# Altium schematic sheet jn5169_blk.SchDoc
size A4; Date: 1/11/2016; Engineer: JBayalas; DocumentNumber: 9; Revision: V5.0.0; SheetNumber: 9; SheetTotal: 13
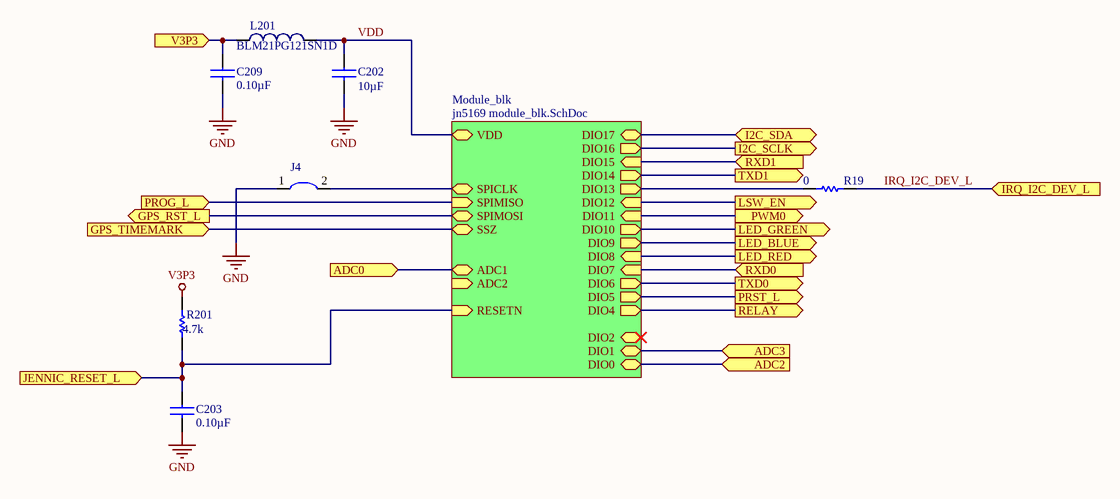
[diagram p0: jn5169_blk.SchDoc]

## Parts
C202  value 10µF  [C1206]  (hidden comment: GRM31CR71C106KAC7L)
C203  value 0.10µF  [C0402]  (hidden comment: GRM155R71H104ME14D)
C209  value 0.10µF  [C0402]  (hidden comment: GRM155R71H104ME14D)
J4  0603 Jumper  [0603 Jumper]  (value not drawn)
L201  BLM21PG121SN1D  [0805 INDUCTOR]
R19  value 0  [R0402]  (hidden comment: RC0402FR-070RL)
R201  value 4.7k  [R0402]  (hidden comment: RC0402FR-074K7P)

## Sub-sheets
Module_blk = jn5169 module_blk.SchDoc: ADC1 (bidir), SPICLK (bidir), SPIMISO (in), SPIMOSI (bidir), SSZ (bidir), DIO0 (bidir), DIO1 (bidir), DIO2 (bidir), VDD (bidir), DIO10 (out), DIO9 (out), DIO8 (in), DIO7 (in), DIO6 (out), DIO5 (out), DIO4 (out), DIO17 (bidir), DIO16 (out), DIO15 (in), DIO14 (out), RESETN (in), DIO13 (out), DIO12 (in), DIO11 (in), ADC2 (in)

## Ports
ADC0 (in), ADC2 (in), ADC3 (in), GPS_RST_L (out), GPS_TIMEMARK (in), I2C_SCLK (out), I2C_SDA (bidir), IRQ_I2C_DEV_L (in), JENNIC_RESET_L (in), LED_BLUE (out), LED_GREEN (out), LED_RED (out), LSW_EN (out), PROG_L (in), PRST_L (out), PWM0 (out), RELAY (out), RXD0 (in), RXD1 (in), TXD0 (out), TXD1 (out), V3P3 (in)

## Nets
GND: C202.2 C203.2 C209.2 J4.1
V3P3: R201.2
ADC0: port ADC0, sheet Module_blk/ADC1
ADC2: port ADC2, sheet Module_blk/DIO0
ADC3: port ADC3, sheet Module_blk/DIO1
GPS_RST_L: port GPS_RST_L, sheet Module_blk/SPIMOSI
GPS_TIMEMARK: port GPS_TIMEMARK, sheet Module_blk/SSZ
I2C_SCLK: port I2C_SCLK, sheet Module_blk/DIO16
I2C_SDA: port I2C_SDA, sheet Module_blk/DIO17
IRQ_I2C_DEV_L: R19.1 ; port IRQ_I2C_DEV_L
JENNIC_RESET_L: C203.1 R201.1 ; port JENNIC_RESET_L, sheet Module_blk/RESETN
LED_BLUE: port LED_BLUE, sheet Module_blk/DIO9
LED_GREEN: port LED_GREEN, sheet Module_blk/DIO10
LED_RED: port LED_RED, sheet Module_blk/DIO8
LSW_EN: port LSW_EN, sheet Module_blk/DIO12
PROG_L: port PROG_L, sheet Module_blk/SPIMISO
PRST_L: port PRST_L, sheet Module_blk/DIO5
PWM0: port PWM0, sheet Module_blk/DIO11
RELAY: port RELAY, sheet Module_blk/DIO4
RXD0: port RXD0, sheet Module_blk/DIO7
RXD1: port RXD1, sheet Module_blk/DIO15
TXD0: port TXD0, sheet Module_blk/DIO6
TXD1: port TXD1, sheet Module_blk/DIO14
V3P3: C209.1 L201.2 ; port V3P3  [a separate net that carries the same name]
VDD: C202.1 L201.1 ; sheet Module_blk/VDD
NetJ4_2: J4.2 ; sheet Module_blk/SPICLK
NetR19_2: R19.2 ; sheet Module_blk/DIO13

## Notes on the sheet
- Title:
- Sheet:
- Date:
- of
- Project:
- Revision:
- Engineer:
- Wi4B S.r.l

## Library data of the parts
C202 = GRM31CR71C106KAC7L: CAP CER 10UF 16V X7R 1206; MFT: Murata Electronics North America; TYPE: SMD; FUNCTION: JN5169 TOPBLK; MPN: GRM31CR71C106KAC7L; RATING: 16V; DNP: *
C203 C209 = GRM155R71H104ME14D: CAP CER 0.1UF 50V X7R 0402; MFT: Murata Electronics North America; TYPE: SMD; FUNCTION: JN5169 TOPBLK; MPN: GRM155R71H104ME14D; RATING: 50V; DNP: *
J4 = 0603 Jumper: FUNCTION: JN5169 TOPBLK
L201 = BLM21PG121SN1D: FERRITE CHIP 120 OHM 0805; MFT: Murata Electronics North America; RATING: 3A; TYPE: Surface Mount; VALUE: 120 Ohm; FUNCTION: JN5169 TOPBLK; MPN: BLM21PG121SN1D
R19 = RC0402FR-070RL: RES 0 OHM JUMPER 1/16W 0402; MFT: YAGEO; FUNCTION: JN5169 TOPBLK; MPN: RC0402FR-070RL; LOAD: *; RATING: *; TYPE: SMD; APN: *
R201 = RC0402FR-074K7P: RES SMD 4.7K OHM 1% 1/16W 0402; MFT: YAGEO; FUNCTION: JN5169 TOPBLK; MPN: RC0402FR-074K7P; RATING: 1/16W; LOAD: *; TYPE: SMD; APN: *